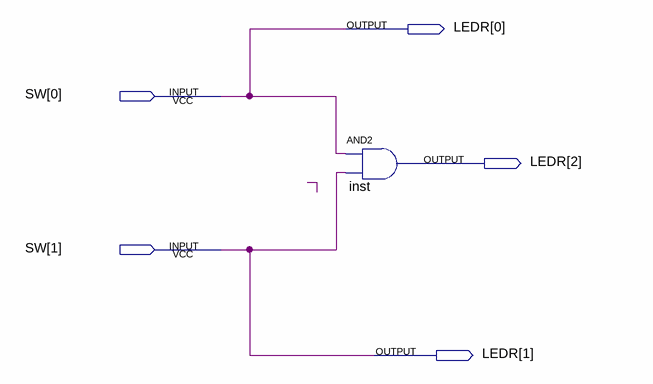
[diagram p0: schematic sheet]
// Quartus schematic Simple_Block_Diagram.bdf as structural Verilog: 1 symbols, 5 pins
module Simple_Block_Diagram (
  input  [1:0] SW,
  output [2:0] LEDR
);

  and inst (LEDR[2], SW[0], SW[1]);

  assign LEDR[1:0] = SW;
endmodule
